# Altium schematic sheet BBB_parport.SchDoc: BBB_parport
size C; DrawnBy: Mr. Thach; Revision: Rev 1.0
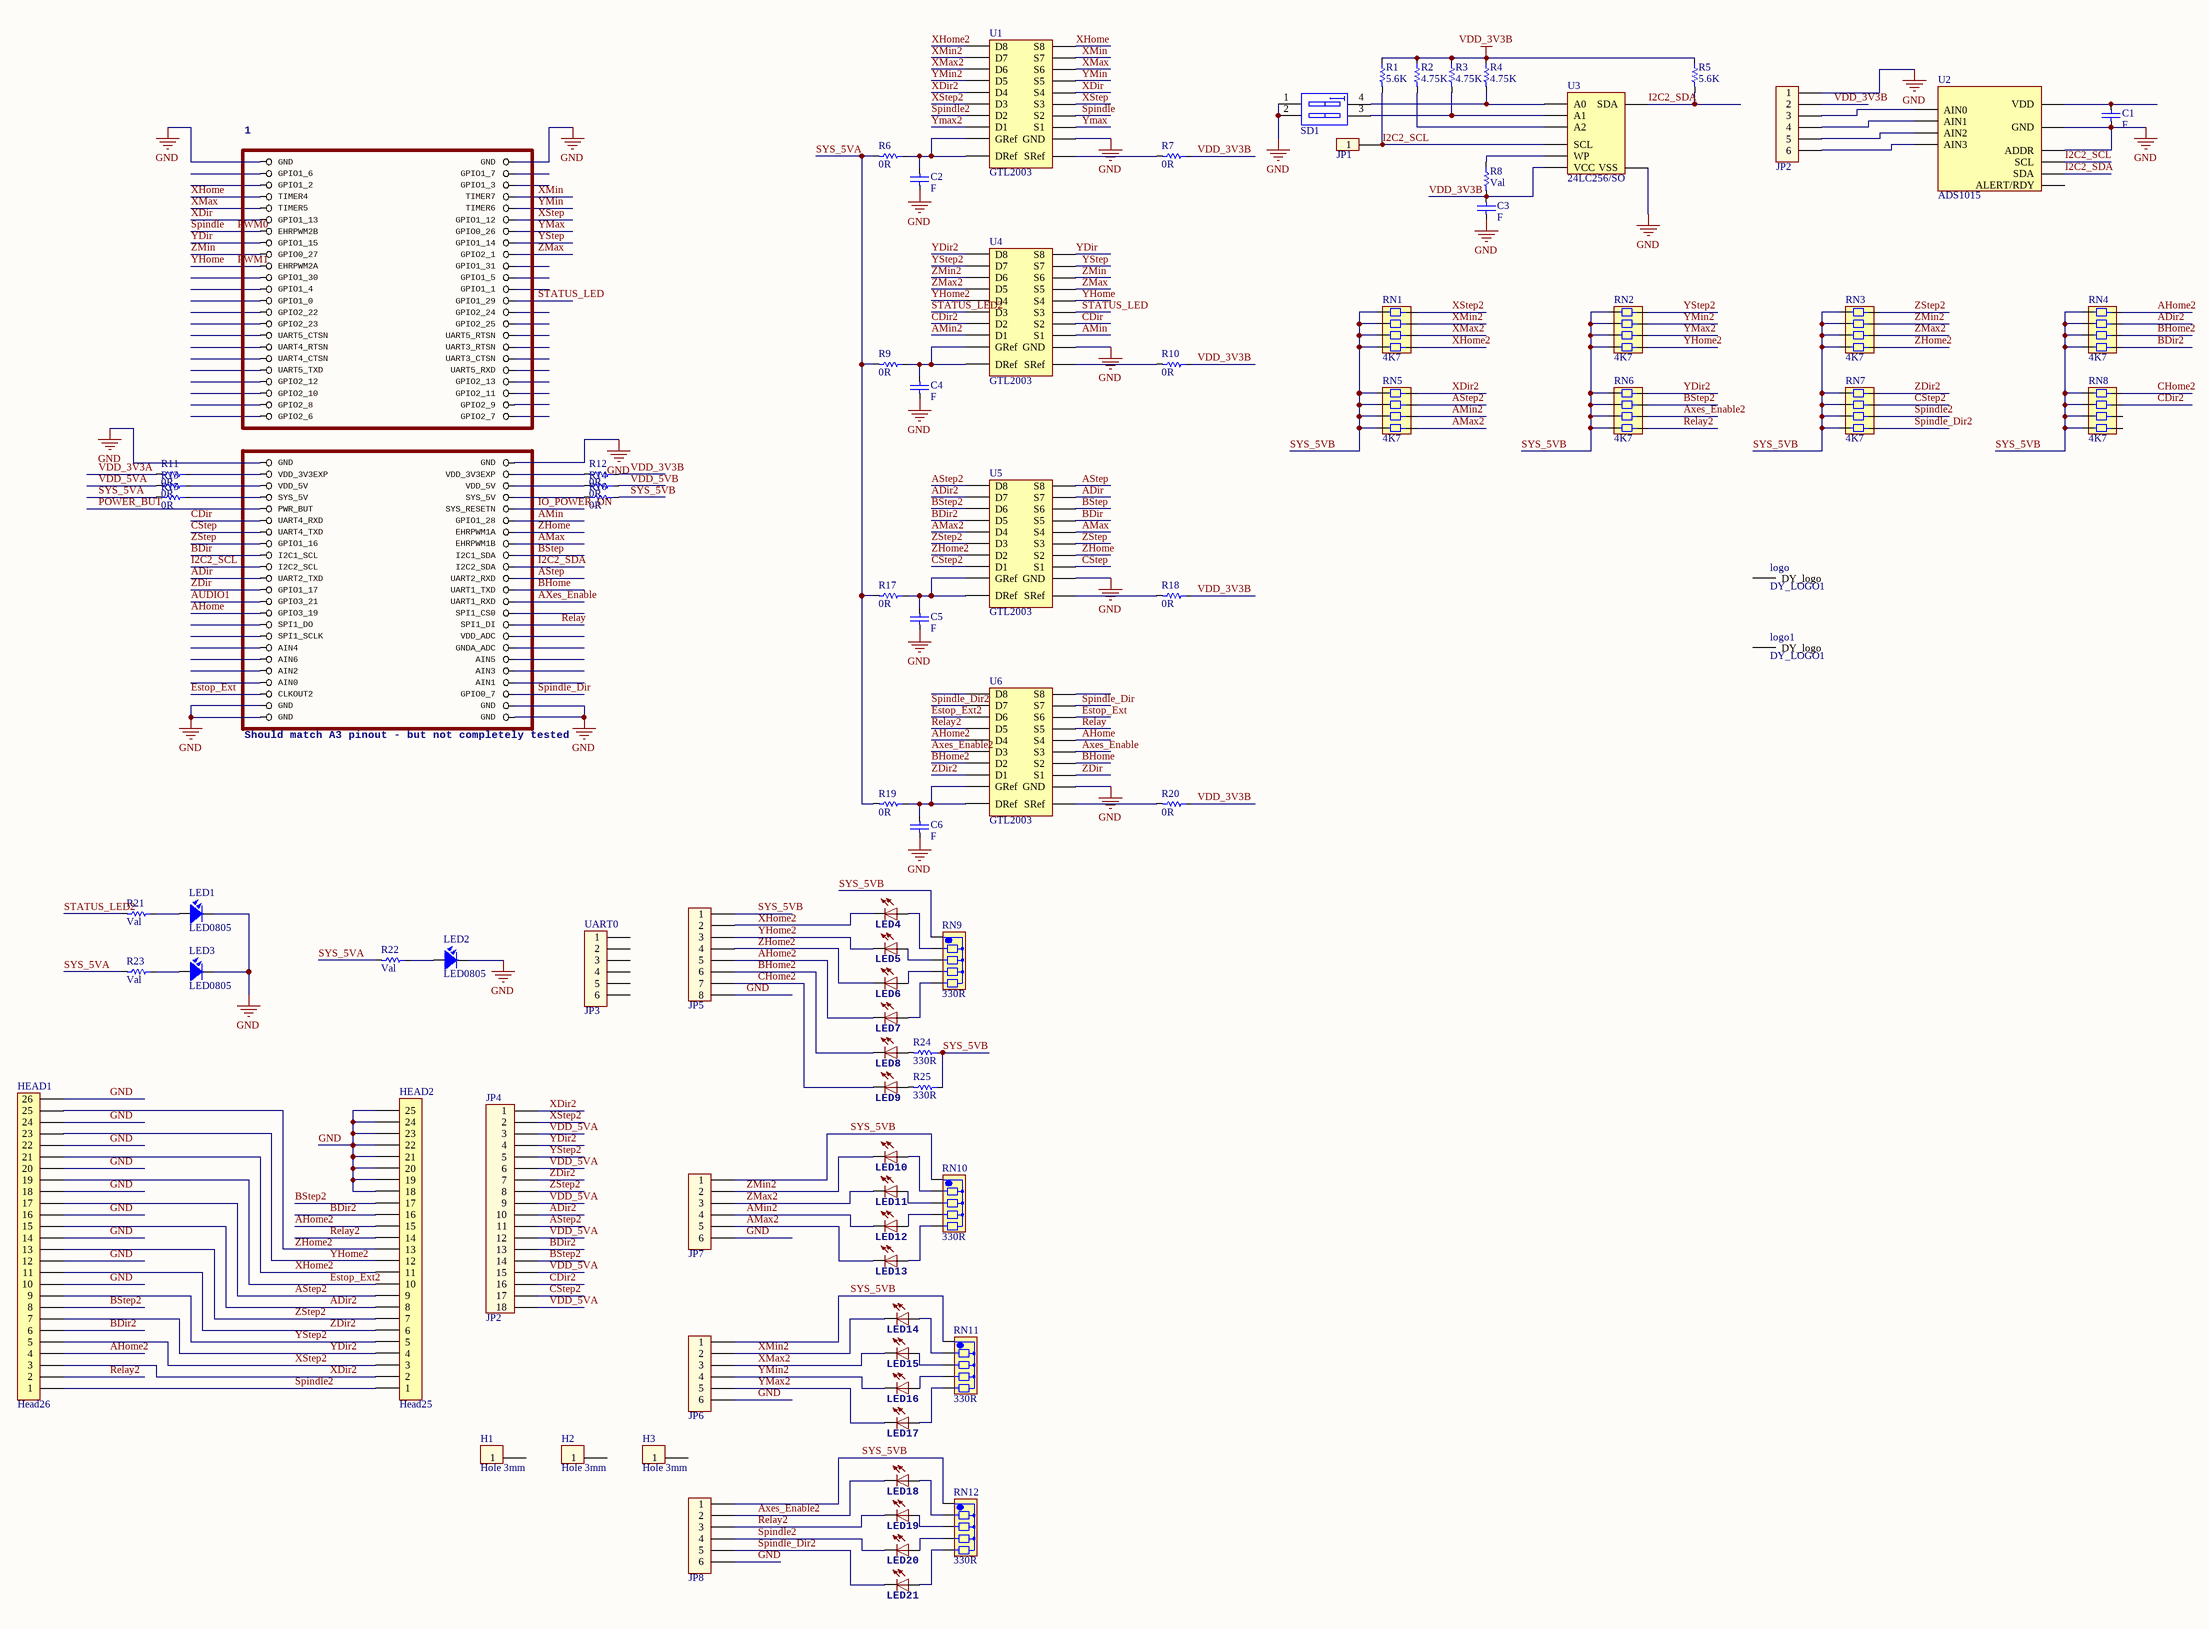
[diagram p0: BBB_parport.SchDoc]

## Parts
1  Should match A3 pinout - but not completely tested  [BEAGLEBONE_SHIELD]
C1  F  [0805_C]
C2  F  [0805_C]
C3  F  [0805_C]
C4  F  [0805_C]
C5  F  [0805_C]
C6  F  [0805_C]
H1  Hole 3mm  [Hole_3mm]
H2  Hole 3mm  [Hole_3mm]
H3  Hole 3mm  [Hole_3mm]
HEAD1  Head26  [HEAD13X2]
HEAD2  Head25  [DB25_MALE]
JP1  JP2  [HEAD1]  (value not drawn)
JP2  JP6  [Domino6_381]  (value not drawn)
JP3  value UART0  [head6]  (hidden comment: JP6)
JP4  JP2  [DOMINO18_508]
JP5  JP8  [DOMINO8_508]  (value not drawn)
JP6  JP6  [DOMINO6_508]  (value not drawn)
JP7  JP6  [DOMINO6_508]  (value not drawn)
JP8  JP6  [DOMINO6_508]  (value not drawn)
LED1  LED0805  [0805_LED]
LED2  LED0805  [0805_LED]
LED3  LED0805  [0805_LED]
LED4  (no value)  [LED3MM]
LED5  (no value)  [LED3MM]
LED6  (no value)  [LED3MM]
LED7  (no value)  [LED3MM]
LED8  (no value)  [LED3MM]
LED9  (no value)  [LED3MM]
LED10  (no value)  [LED3MM]
LED11  (no value)  [LED3MM]
LED12  (no value)  [LED3MM]
LED13  (no value)  [LED3MM]
LED14  (no value)  [LED3MM]
LED15  (no value)  [LED3MM]
LED16  (no value)  [LED3MM]
LED17  (no value)  [LED3MM]
LED18  (no value)  [LED3MM]
LED19  (no value)  [LED3MM]
LED20  (no value)  [LED3MM]
LED21  (no value)  [LED3MM]
logo  DY_LOGO1  [DYLOGO4]
logo1  DY_LOGO1  [DYLOGO4]
R1  0805_R  [0805_R]  (value not drawn)
R2  0805_R  [0805_R]  (value not drawn)
R3  0805_R  [0805_R]  (value not drawn)
R4  0805_R  [0805_R]  (value not drawn)
R5  0805_R  [0805_R]  (value not drawn)
R6  0805_R  [0805_R]  (value not drawn)
R7  0805_R  [0805_R]  (value not drawn)
R8  0805_R  [0805_R]  (value not drawn)
R9  0805_R  [0805_R]  (value not drawn)
R10  0805_R  [0805_R]  (value not drawn)
R11  0805_R  [0805_R]  (value not drawn)
R12  0805_R  [0805_R]  (value not drawn)
R13  0805_R  [0805_R]  (value not drawn)
R14  0805_R  [0805_R]  (value not drawn)
R15  0805_R  [0805_R]  (value not drawn)
R16  0805_R  [0805_R]  (value not drawn)
R17  0805_R  [0805_R]  (value not drawn)
R18  0805_R  [0805_R]  (value not drawn)
R19  0805_R  [0805_R]  (value not drawn)
R20  0805_R  [0805_R]  (value not drawn)
R21  0805_R  [0805_R]  (value not drawn)
R22  0805_R  [0805_R]  (value not drawn)
R23  0805_R  [0805_R]  (value not drawn)
R24  0805_R  [0805_R]  (value not drawn)
R25  0805_R  [0805_R]  (value not drawn)
RN1  4K7  [RESCAXS50P160X320X70-8N]
RN2  4K7  [RESCAXS50P160X320X70-8N]
RN3  4K7  [RESCAXS50P160X320X70-8N]
RN4  4K7  [RESCAXS50P160X320X70-8N]
RN5  4K7  [RESCAXS50P160X320X70-8N]
RN6  4K7  [RESCAXS50P160X320X70-8N]
RN7  4K7  [RESCAXS50P160X320X70-8N]
RN8  4K7  [RESCAXS50P160X320X70-8N]
RN9  330R  [RN4_THROUGHHOLE]
RN10  330R  [RN4_THROUGHHOLE]
RN11  330R  [RN4_THROUGHHOLE]
RN12  330R  [RN4_THROUGHHOLE]
SD1  SW - DIP2  [SW_DIP_2POS_THR]  (value not drawn)
U1  GTL2003  [TSSOP20]
U2  ADS1015  [VSSOP10]
U3  24LC256/SO  [SOIC8_Wide]
U4  GTL2003  [TSSOP20]
U5  GTL2003  [TSSOP20]
U6  GTL2003  [TSSOP20]

## Nets
GND: 1.1(GND) 1.2(GND) 1.47(GND) 1.48(GND) 1.89(GND) 1.90(GND) 1.91(GND) 1.92(GND) C1.1 C2.1 C3.1 C4.1 C5.1 C6.1 HEAD1.10 HEAD1.12 HEAD1.14 HEAD1.16 HEAD1.18 HEAD1.20 HEAD1.22 HEAD1.24 HEAD1.26 HEAD2.18 HEAD2.19 HEAD2.20 HEAD2.21 HEAD2.22 HEAD2.23 HEAD2.24 HEAD2.25 JP2.1 JP5.8 JP6.6 JP7.6 JP8.6 LED1.2 LED2.2 LED3.2 SD1.1(A1) SD1.2(A2) U1.1(GND) U2.1(ADDR) U2.3(GND) U3.4(VSS) U4.1(GND) U5.1(GND) U6.1(GND)
VDD_3V3B: C3.2 JP2.2 R1.1 R2.1 R3.1 R4.1 R5.1 R7.1 R8.2 R10.1 R12.1 R18.1 R20.1 U3.8(VCC)
ADir: 1.67(UART2_TXD) U5.9(S7)
ADir2: HEAD1.15 HEAD2.8 JP4.10 RN4.3 U5.12(D7)
AHome: 1.73(GPIO3_19) U6.6(S4)
AHome2: HEAD1.4 HEAD2.15 JP5.5 LED7.K(C) RN4.4 U6.15(D4)
AMax: 1.62(EHRPWM1B) U5.6(S4)
AMax2: JP7.5 LED13.K(C) RN5.1 U5.15(D4)
AMin: 1.58(GPIO1_28) U4.3(S1)
AMin2: JP7.4 LED12.K(C) RN5.2 U4.18(D1)
AStep: 1.68(UART2_RXD) U5.10(S8)
AStep2: HEAD1.17 HEAD2.9 JP4.11 RN5.3 U5.11(D8)
AUDIO1: 1.71(GPIO3_21)
Axes_Enable: 1.72(UART1_RXD) U6.5(S3)
Axes_Enable2: JP8.2 LED18.K(C) RN6.2 U6.16(D3)
BDir: 1.63(I2C1_SCL) U5.7(S5)
BDir2: HEAD1.6 HEAD2.16 JP4.13 RN4.1 U5.14(D5)
BHome: 1.70(UART1_TXD) U6.4(S2)
BHome2: JP5.6 LED8.K(C) RN4.2 U6.17(D2)
BStep: 1.64(I2C1_SDA) U5.8(S6)
BStep2: HEAD1.8 HEAD2.17 JP4.14 RN6.3 U5.13(D6)
CDir: 1.57(UART4_RXD) U4.4(S2)
CDir2: JP4.16 RN8.3 U4.17(D2)
CHome2: JP5.7 LED9.K(C) RN8.4
CStep: 1.59(UART4_TXD) U5.3(S1)
CStep2: JP4.17 RN7.3 U5.18(D1)
Estop_Ext: 1.87(CLKOUT2) U6.8(S6)
Estop_Ext2: HEAD1.19 HEAD2.10 U6.13(D6)
I2C2_SCL: 1.65(I2C2_SCL) JP1.1 R1.2 U2.10(SCL) U3.6(SCL)
I2C2_SDA: 1.66(I2C2_SDA) R5.2 U2.9(SDA) U3.5(SDA)
IO_POWER_ON: 1.56(SYS_RESETN)
POWER_BUT: 1.55(PWR_BUT)
PWM0: 1.13(EHRPWM2B) U1.4(S2)  [also labelled Spindle]
PWM1: 1.19(EHRPWM2A) U4.6(S4)  [also labelled YHome]
Relay: 1.76(SPI1_DI) U6.7(S5)
Relay2: HEAD1.2 HEAD2.14 JP8.3 LED19.K(C) RN6.1 U6.14(D5)
Spindle2: HEAD1.1 HEAD2.1 JP8.4 LED20.K(C) RN7.2 U1.17(D2)
Spindle_Dir: 1.88(GPIO0_7) U6.9(S7)
Spindle_Dir2: JP8.5 LED21.K(C) RN7.1 U6.12(D7)
STATUS_LED: 1.26(GPIO1_29) U4.5(S3)
STATUS_LED2: R21.2 U4.16(D3)
SYS_5VA: R6.2 R9.2 R15.2 R17.2 R19.2 R22.2 R23.2
SYS_5VB: JP5.1 JP6.1 JP7.1 JP8.1 R16.1 R24.1 R25.1 RN1.5 RN1.6 RN1.7 RN1.8 RN2.5 RN2.6 RN2.7 RN2.8 RN3.5 RN3.6 RN3.7 RN3.8 RN4.5 RN4.6 RN4.7 RN4.8 RN5.5 RN5.6 RN5.7 RN5.8 RN6.5 RN6.6 RN6.7 RN6.8 RN7.5 RN7.6 RN7.7 RN7.8 RN8.5 RN8.6 RN8.7 RN8.8 RN9.1 RN10.1 RN11.1 RN12.1
VDD_3V3A: R11.2
VDD_5VA: JP4.3 JP4.6 JP4.9 JP4.12 JP4.15 JP4.18 R13.2
VDD_5VB: R14.1
XDir: 1.11(GPIO1_13) U1.6(S4)
XDir2: HEAD1.3 HEAD2.2 JP4.1 RN5.4 U1.15(D4)
XHome: 1.7(TIMER4) U1.10(S8)
XHome2: HEAD1.21 HEAD2.11 JP5.2 LED4.K(C) RN1.1 U1.11(D8)
XMax: 1.9(TIMER5) U1.8(S6)
XMax2: JP6.3 LED15.K(C) RN1.2 U1.13(D6)
XMin: 1.8(TIMER7) U1.9(S7)
XMin2: JP6.2 LED14.K(C) RN1.3 U1.12(D7)
XStep: 1.12(GPIO1_12) U1.5(S3)
XStep2: HEAD1.5 HEAD2.3 JP4.2 RN1.4 U1.16(D3)
YDir: 1.15(GPIO1_15) U4.10(S8)
YDir2: HEAD1.7 HEAD2.4 JP4.4 RN6.4 U4.11(D8)
YHome2: HEAD1.23 HEAD2.12 JP5.3 LED5.K(C) RN2.1 U4.15(D4)
Ymax: 1.14(GPIO0_26) U1.3(S1)
Ymax2: JP6.5 LED17.K(C) RN2.2 U1.18(D1)
YMin: 1.10(TIMER6) U1.7(S5)
YMin2: JP6.4 LED16.K(C) RN2.3 U1.14(D5)
YStep: 1.16(GPIO1_14) U4.9(S7)
YStep2: HEAD1.9 HEAD2.5 JP4.5 RN2.4 U4.12(D7)
ZDir: 1.69(GPIO1_17) U6.3(S1)
ZDir2: HEAD1.11 HEAD2.6 JP4.7 RN7.4 U6.18(D1)
ZHome: 1.60(EHRPWM1A) U5.4(S2)
ZHome2: HEAD1.25 HEAD2.13 JP5.4 LED6.K(C) RN3.1 U5.17(D2)
ZMax: 1.18(GPIO2_1) U4.7(S5)
ZMax2: JP7.3 LED11.K(C) RN3.2 U4.14(D5)
ZMin: 1.17(GPIO0_27) U4.8(S6)
ZMin2: JP7.2 LED10.K(C) RN3.3 U4.13(D6)
ZStep: 1.61(GPIO1_16) U5.5(S3)
ZStep2: HEAD1.13 HEAD2.7 JP4.8 RN3.4 U5.16(D3)
Net1_49: 1.49(VDD_3V3EXP) R11.1
Net1_50: 1.50(VDD_3V3EXP) R12.2
Net1_51: 1.51(VDD_5V) R13.1
Net1_52: 1.52(VDD_5V) R14.2
Net1_53: 1.53(SYS_5V) R15.1
Net1_54: 1.54(SYS_5V) R16.2
NetC1_2: C1.2 U2.8(VDD)
NetC2_2: C2.2 R6.1 U1.19(DRef) U1.20(GRef)
NetC4_2: C4.2 R9.1 U4.19(DRef) U4.20(GRef)
NetC5_2: C5.2 R17.1 U5.19(DRef) U5.20(GRef)
NetC6_2: C6.2 R19.1 U6.19(DRef) U6.20(GRef)
NetJP2_3: JP2.3 U2.4(AIN0)
NetJP2_4: JP2.4 U2.5(AIN1)
NetJP2_5: JP2.5 U2.6(AIN2)
NetJP2_6: JP2.6 U2.7(AIN3)
NetLED1_1: LED1.1 R21.1
NetLED2_1: LED2.1 R22.1
NetLED3_1: LED3.1 R23.1
NetLED4_A: LED4.A RN9.2
NetLED5_A: LED5.A RN9.3
NetLED6_A: LED6.A RN9.4
NetLED7_A: LED7.A RN9.5
NetLED8_A: LED8.A R24.2
NetLED9_A: LED9.A R25.2
NetLED10_A: LED10.A RN10.2
NetLED11_A: LED11.A RN10.3
NetLED12_A: LED12.A RN10.4
NetLED13_A: LED13.A RN10.5
NetLED14_A: LED14.A RN11.2
NetLED15_A: LED15.A RN11.3
NetLED16_A: LED16.A RN11.4
NetLED17_A: LED17.A RN11.5
NetLED18_A: LED18.A RN12.2
NetLED19_A: LED19.A RN12.3
NetLED20_A: LED20.A RN12.4
NetLED21_A: LED21.A RN12.5
NetR2_2: R2.2 U3.3(A2)
NetR3_2: R3.2 SD1.3(A3) U3.2(A1)
NetR4_2: R4.2 SD1.4(A4) U3.1(A0)
NetR7_2: R7.2 U1.2(SRef)
NetR8_1: R8.1 U3.7(WP)
NetR10_2: R10.2 U4.2(SRef)
NetR18_2: R18.2 U5.2(SRef)
NetR20_2: R20.2 U6.2(SRef)

Not connected (* = marked no-connect by the designer): 1 3(GPIO1_6) 4(GPIO1_7) 5(GPIO1_2) 6(GPIO1_3) 20(GPIO1_31) 21(GPIO1_30) 22(GPIO1_5) 23(GPIO1_4) 24(GPIO1_1) 25(GPIO1_0) 27(GPIO2_22) 28(GPIO2_24) 29(GPIO2_23) 30(GPIO2_25) 31(UART5_CTSN) 32(UART5_RTSN) 33(UART4_RTSN) 34(UART3_RTSN) 35(UART4_CTSN) 36(UART3_CTSN) 37(UART5_TXD) 38(UART5_RXD) 39(GPIO2_12) 40(GPIO2_13) 41(GPIO2_10) 42(GPIO2_11) 43(GPIO2_8) 44(GPIO2_9) 45(GPIO2_6) 46(GPIO2_7) 74(SPI1_CS0) 75(SPI1_DO) 77(SPI1_SCLK) 78(VDD_ADC) 79(AIN4) 80(GNDA_ADC) 81(AIN6) 82(AIN5) 83(AIN2) 84(AIN3) 85(AIN0) 86(AIN1); H1 1; H2 1; H3 1; JP3 1 2 3 4 5 6; logo 0(DY_logo); logo1 0(DY_logo); RN8 1 2; U2 2(ALERT/RDY); U6 10(S8) 11(D8)

## Notes on the sheet
- (in symbol 0805_R) 0R; 5.6K; 4.75K; Val; 330R

## Library data of the parts
1 = BEAGLEBONE_OUTLINE
C1-C6 = 0805_C: 0805 SMD capacitor
H1-H3 = Hole_3mm
JP1 = Head1: Connector 1; Value: Connector 2
JP2 JP3 JP6-JP8 = HEAD6: Connector 6
  JP2 JP6-JP8: Value: Connector 6
JP4 = Head18
JP5 = HEAD8: Connector 8; Value: Connector 8
LED1-LED3 = LED0805: LED Single colour Green and Red; Value: LED 3 ly Single Colour
LED4-LED21 = LED3MM
R1-R25 = 0805_R: 0805 SMD resistor
RN1-RN8 = RN4: Resistor 4 (thanh); Value: Tro thanh 4K7
RN9-RN12 = RN4_th: Resistor 4 (thanh); Value: Tro thanh 4K7
SD1 = SWDIP-2: DIP Switch, 2 Position, SPST; Value: SW - DIP2